# Altium schematic sheet anodes.SchDoc: DE:TMP:11:UC:EXPANDIDO
size 127 x 76 mm; Date: 21-07-2022; SheetNumber: 1; SheetTotal: 1; WebFGR: www.abebashop.com; VersionFGR: 20220721; PageSetup: Record=PageOptions|CenterHorizontal=True|CenterVertical=True|PrintScale=0.94|XCorrection=1.00|YCorrection=1.00|PrintKind=0|BorderSize=5000000|LeftOffset=0|BottomOffset=0|Orientation=2|PaperLength=1000|PaperWidth=1000|Scale=100|PaperSource=7|PrintQuality=-4|MediaType=1|DitherType=10|PaperKind=Letter|PrintScaleMode=1
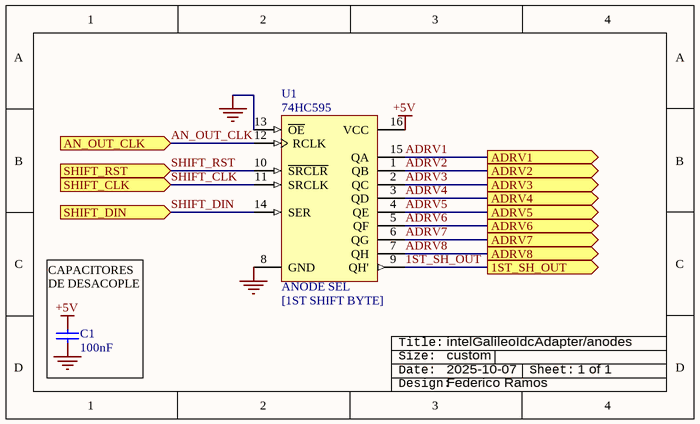
[diagram p0: anodes.SchDoc]

## Parts
C1  value 100nF  [c1206]  (hidden comment: Cap)
ROT?  Rotulo_empty  (value not drawn)  (graphical)
U1  74HC595  [DIP16]

## Ports
1ST_SH_OUT (out), ADRV1 (out), ADRV2 (out), ADRV3 (out), ADRV4 (out), ADRV5 (out), ADRV6 (out), ADRV7 (out), ADRV8 (out), AN_OUT_CLK (in), SHIFT_CLK (in), SHIFT_DIN (in), SHIFT_RST (in)

## Nets
+5V: C1.2 U1.16(VCC)
GND: C1.1 U1.8(GND) U1.13(~{OE})
1ST_SH_OUT: U1.9(QH') ; port 1ST_SH_OUT
ADRV1: U1.15(QA) ; port ADRV1
ADRV2: U1.1(QB) ; port ADRV2
ADRV3: U1.2(QC) ; port ADRV3
ADRV4: U1.3(QD) ; port ADRV4
ADRV5: U1.4(QE) ; port ADRV5
ADRV6: U1.5(QF) ; port ADRV6
ADRV7: U1.6(QG) ; port ADRV7
ADRV8: U1.7(QH) ; port ADRV8
AN_OUT_CLK: U1.12(RCLK) ; port AN_OUT_CLK
SHIFT_CLK: U1.11(SRCLK) ; port SHIFT_CLK
SHIFT_DIN: U1.14(SER) ; port SHIFT_DIN
SHIFT_RST: U1.10(~{SRCLR}) ; port SHIFT_RST

## Notes on the sheet
- (near C1) CAPACITORES DE DESACOPLE
- intelGalileoIdcAdapter/anodes
- custom
- 2025-10-07
- (near ROT?) 1 of 1
- Federico Ramos
- (in symbol 74HC595) ANODE SEL; [1ST SHIFT BYTE]
- (in symbol Rotulo_empty) Title:; Size:; Date:; Sheet:; Design:

## Library data of the parts
C1 = Cap: Capacitor; Voltage: 50V; Price: 0.25; Technology: Ceramic
ROT? = Rotulo_empty: Rotulo [consolas]
U1 = 74HC595: 8-Bit Shift Register with 3-State Output Registers